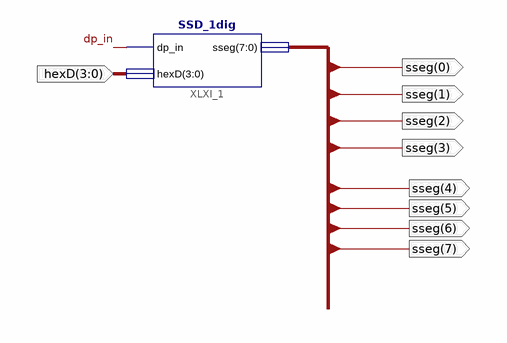
[diagram p0: schematic sheet 1]
// Xilinx ISE schematic lab6_experiment2.sch (spartan3e) as structural Verilog: 1 symbols, 9 ports
module lab6_experiment2 (
  input  [3:0] hexD,
  output [7:0] sseg
);

  wire dp_in;

  SSD_1dig XLXI_1 (.dp_in(dp_in), .hexD(hexD), .sseg(sseg));
endmodule
